# EAGLE design Module_PowerSource (EAGLE 9.6.2)
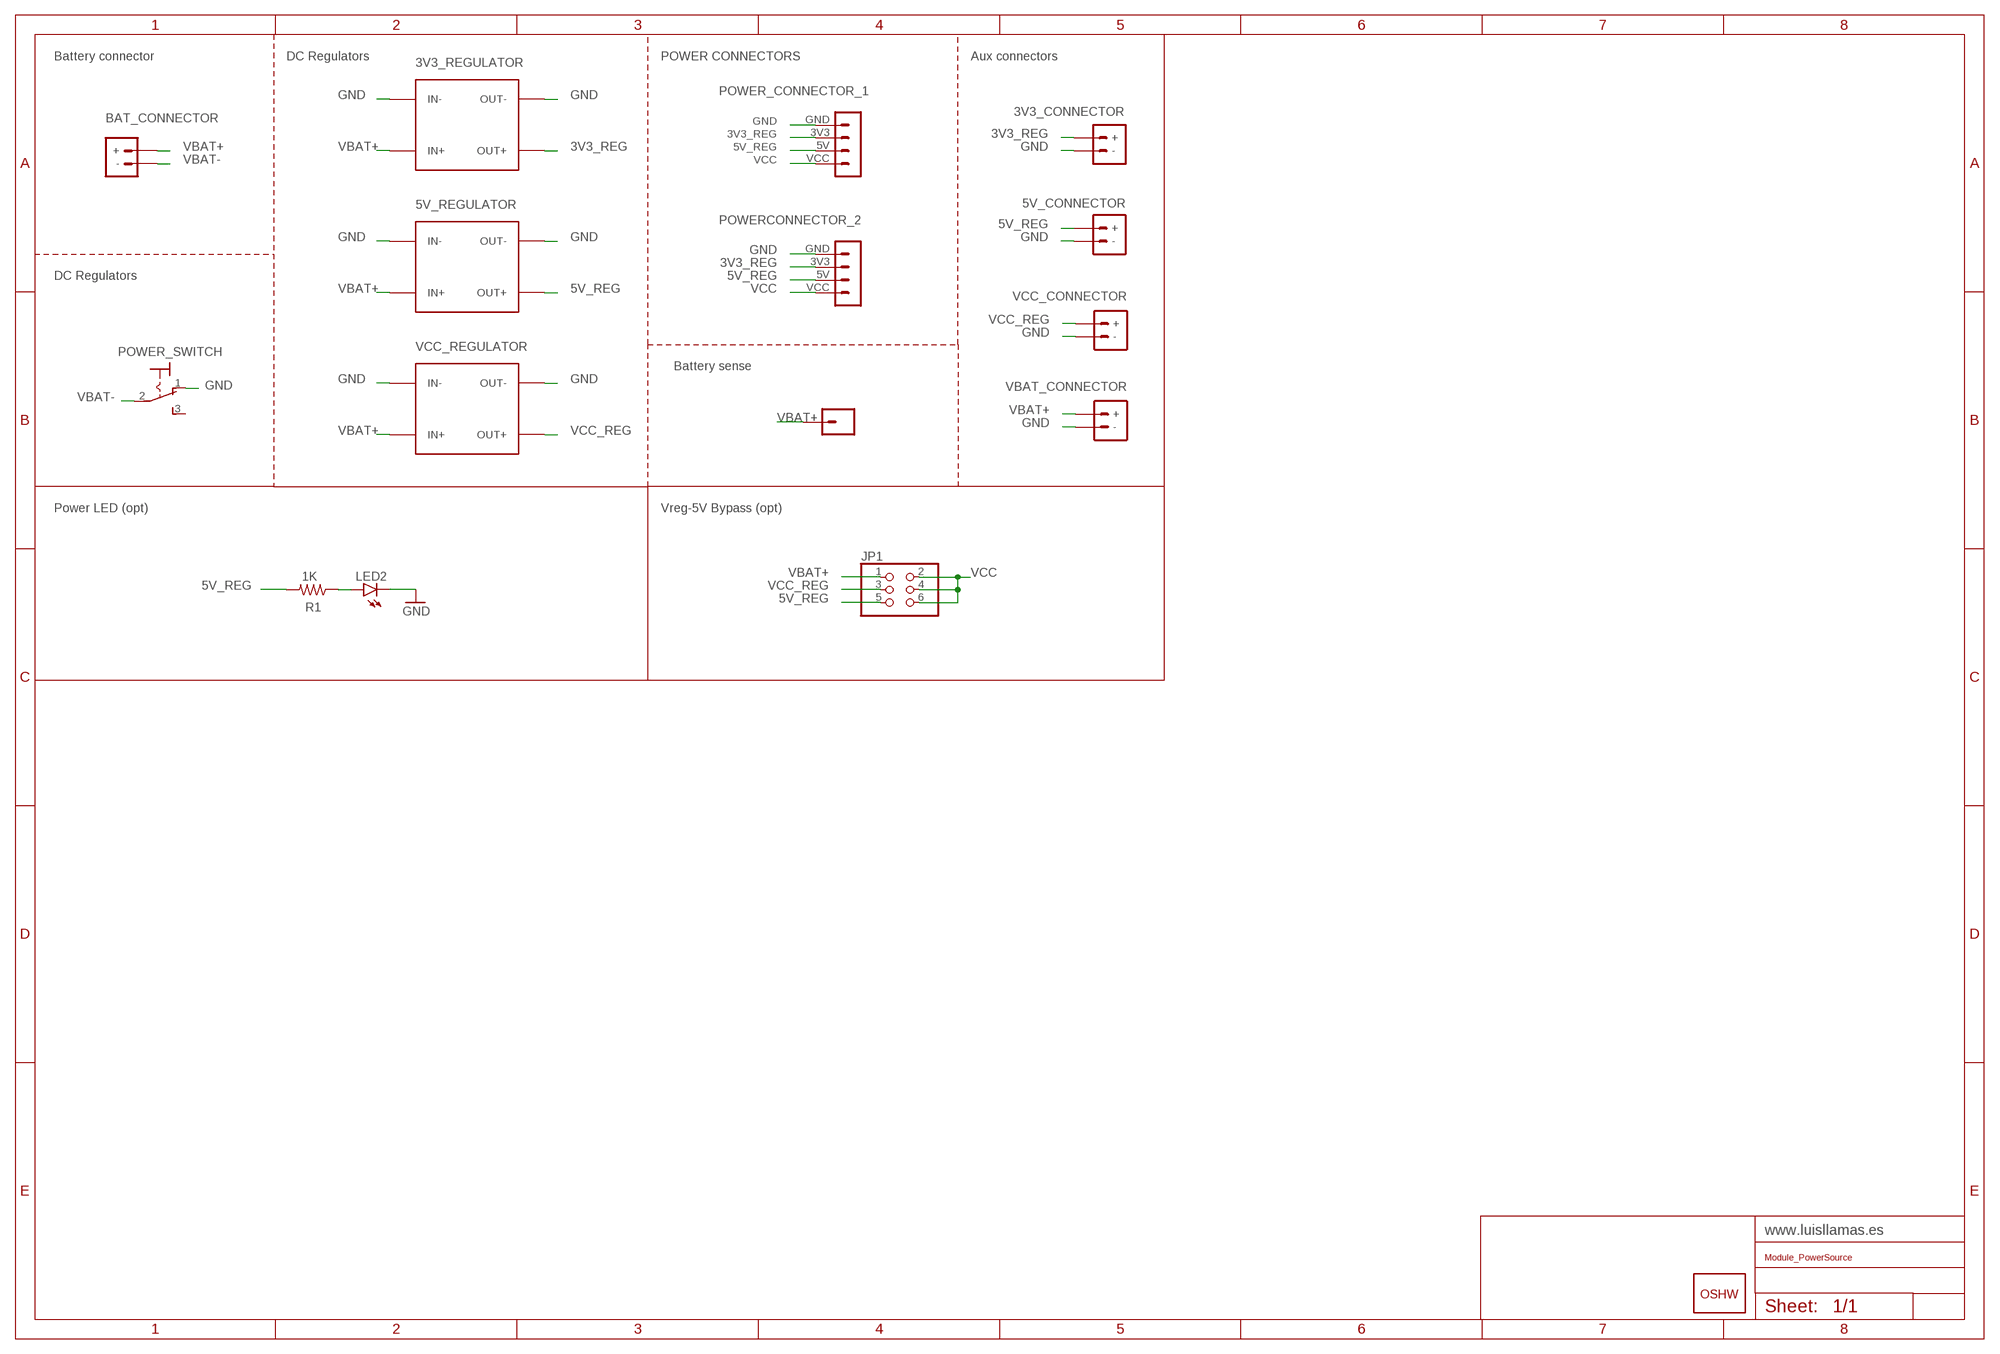
[diagram p0: schematic, sheet 1]

## Parts
3V3_CONNECTOR  MOTOR-TERMINAL2.54MM_SCREWTERM  [1X02_2.54_SCREWTERM]
3V3_REGULATOR  MINI-DC-STEP-DOWN-MP2307  [MINI-DC-STEP-DOWN-MP2307]
5V_CONNECTOR  MOTOR-TERMINAL2.54MM_SCREWTERM  [1X02_2.54_SCREWTERM]
5V_REGULATOR  MINI-DC-STEP-DOWN-MP2307  [MINI-DC-STEP-DOWN-MP2307]
BAT_CONNECTOR  POWER-TERMINAL5MM  [SCREWTERMINAL-5MM-2]
GOLD_ORB_SM1  OSHWLOGO_GOLD_ORB_MED  [OSHW1]
J3  CONN_01  [1X01]
JP1  JUMPER_3X2/OCT  [JUMPER_3X2]
LED2  LEDCHIP-LED0805  [CHIP-LED0805]
POWER_CONNECTOR_1  POWER-CONNECTOR  [POWER-CONNECTOR]
POWER_SWITCH  LEVER-POWER-SWITCH  [LEVER-POWER-SWITCH]
POWERCONNECTOR_2  POWER-CONNECTOR  [POWER-CONNECTOR]
R1  1K  R-US_R0805  [R0805]
VBAT_CONNECTOR  MOTOR-TERMINAL2.54MM_SCREWTERM  [1X02_2.54_SCREWTERM]
VCC_CONNECTOR  MOTOR-TERMINAL2.54MM_SCREWTERM  [1X02_2.54_SCREWTERM]
VCC_REGULATOR  MINI-DC-STEP-DOWN-MP2307  [MINI-DC-STEP-DOWN-MP2307]

## Nets
3V3_REG: 3V3_CONNECTOR.+ 3V3_REGULATOR.OUT2.+(OUT+) 3V3_REGULATOR.OUT+ POWER_CONNECTOR_1.3V3 POWERCONNECTOR_2.3V3
5V_REG: 5V_CONNECTOR.+ 5V_REGULATOR.OUT2.+(OUT+) 5V_REGULATOR.OUT+ JP1.5 POWER_CONNECTOR_1.5V POWERCONNECTOR_2.5V R1.2
GND: 3V3_CONNECTOR.- 3V3_REGULATOR.IN- 3V3_REGULATOR.OUT- 5V_CONNECTOR.- 5V_REGULATOR.IN- 5V_REGULATOR.OUT- LED2.C POWER_CONNECTOR_1.GND POWER_SWITCH.1(O) POWERCONNECTOR_2.GND VBAT_CONNECTOR.- VCC_CONNECTOR.- VCC_REGULATOR.IN- VCC_REGULATOR.OUT-
N$1: LED2.A R1.1
VBAT+: 3V3_REGULATOR.IN+ 3V3_REGULATOR.IN.2+(IN+) 5V_REGULATOR.IN+ 5V_REGULATOR.IN.2+(IN+) BAT_CONNECTOR.+ J3.1 JP1.1 VBAT_CONNECTOR.+ VCC_REGULATOR.IN+ VCC_REGULATOR.IN.2+(IN+)
VBAT-: BAT_CONNECTOR.- POWER_SWITCH.2(P)
VCC: JP1.2 JP1.4 JP1.6 POWER_CONNECTOR_1.VCC POWERCONNECTOR_2.VCC
VCC_REG: JP1.3 VCC_CONNECTOR.+ VCC_REGULATOR.OUT2.+(OUT+) VCC_REGULATOR.OUT+
Unconnected: POWER_SWITCH.3(S)

## Notes on the sheet
- Battery connector | DC Regulators | POWER CONNECTORS | Aux connectors
- DC Regulators
- Battery sense
- Power LED (opt) | Vreg-5V Bypass (opt)

## Library data of the parts
3V3_CONNECTOR 5V_CONNECTOR VBAT_CONNECTOR VCC_CONNECTOR = LLL_Motors:MOTOR-TERMINAL: Multi connection point. Often used as Generic Header-pin footprint for 0.1 inch spaced/style header connections On any of the 0.1 inch spaced packages, you can populate with these: Break Away Headers - Straight <https://www.sparkfun.com/products/116> (PRT-00116) Break Away Male Headers - Right Angle <https://www.sparkfun.com/products/553> (PRT-00553) Female Headers <https://www.sparkfun.com/products/115> (PRT-00115) Break Away Headers - Machine Pin <https://www.sparkfun.com/products/117> (PRT-00117) Break Away Female Headers - Swiss Machine Pin <https://www.sparkfun.com/products/743> (PRT-00743) For SCREWTERMINALS and SPRING TERMINALS visit here: Screw Terimnals on SparkFun.com <https://www.sparkfun.com/search/results?term=Screw+Terminals> (5mm/3.5mm/2.54mm spacing) This device is also useful as a general connection point to wire up your design to another part of your project. Our various solder wires solder well into these plated through hole pads. Hook-Up Wire - Assortment (Stranded, 22 AWG) <https://www.sparkfun.com/products/11375> (PRT-11375) Hook-Up Wire - Assortment (Solid Core, 22 AWG) <https://www.sparkfun.com/products/11367> (PRT-11367) View the entire wire category on our website here <https://www.sparkfun.com/categories/141> Special notes: Molex polarized connector foot print use with: PRT-08233 with associated crimp pins and housings. 2.54_SCREWTERM for use with PRT-10571. 3.5mm Screw Terminal footprints for PRT-08084 5mm Screw Terminal footprints for use with PRT-08432
3V3_REGULATOR 5V_REGULATOR VCC_REGULATOR = LLL_Power:MINI-DC-STEP-DOWN-MP2307: DC/DC Step-Down Regulator based on MP2307DN chip MP2307 datasheet available here: https://cdn-shop.adafruit.com/datasheets/MP2307_r1.9.pdf Click here to find device on ebay.com <http://www.ebay.com/sch/dc+dc+3a+mini+converter>
BAT_CONNECTOR = LLL_Power:POWER-TERMINAL: Multi connection point. Often used as Generic Header-pin footprint for 0.1 inch spaced/style header connections On any of the 0.1 inch spaced packages, you can populate with these: Break Away Headers - Straight <https://www.sparkfun.com/products/116> (PRT-00116) Break Away Male Headers - Right Angle <https://www.sparkfun.com/products/553> (PRT-00553) Female Headers <https://www.sparkfun.com/products/115> (PRT-00115) Break Away Headers - Machine Pin <https://www.sparkfun.com/products/117> (PRT-00117) Break Away Female Headers - Swiss Machine Pin <https://www.sparkfun.com/products/743> (PRT-00743) For SCREWTERMINALS and SPRING TERMINALS visit here: Screw Terimnals on SparkFun.com <https://www.sparkfun.com/search/results?term=Screw+Terminals> (5mm/3.5mm/2.54mm spacing) This device is also useful as a general connection point to wire up your design to another part of your project. Our various solder wires solder well into these plated through hole pads. Hook-Up Wire - Assortment (Stranded, 22 AWG) <https://www.sparkfun.com/products/11375> (PRT-11375) Hook-Up Wire - Assortment (Solid Core, 22 AWG) <https://www.sparkfun.com/products/11367> (PRT-11367) View the entire wire category on our website here <https://www.sparkfun.com/categories/141> Special notes: Molex polarized connector foot print use with: PRT-08233 with associated crimp pins and housings. 2.54_SCREWTERM for use with PRT-10571. 3.5mm Screw Terminal footprints for PRT-08084 5mm Screw Terminal footprints for use with PRT-08432; SF_SKU: PRT-08432
GOLD_ORB_SM1 = LLL_Frames:OSHWLOGO: These are Open-Source Hardware logos.
J3 = SparkFun-Connectors:CONN_01: Single connection point. Often used as Generic Header-pin footprint for 0.1 inch spaced/style header connections On any of the 0.1 inch spaced packages, you can populate with these: Break Away Headers - Straight <https://www.sparkfun.com/products/116> (PRT-00116) Break Away Male Headers - Right Angle <https://www.sparkfun.com/products/553> (PRT-00553) Female Headers <https://www.sparkfun.com/products/115> (PRT-00115) Break Away Headers - Machine Pin <https://www.sparkfun.com/products/117> (PRT-00117) Break Away Female Headers - Swiss Machine Pin <https://www.sparkfun.com/products/743> (PRT-00743) This device is also useful as a general connection point to wire up your design to another part of your project. Our various solder wires solder well into these plated through hole pads. Hook-Up Wire - Assortment (Stranded, 22 AWG) <https://www.sparkfun.com/products/11375> (PRT-11375) Hook-Up Wire - Assortment (Solid Core, 22 AWG) <https://www.sparkfun.com/products/11367> (PRT-11367) View the entire wire category on our website here <https://www.sparkfun.com/categories/141> Special notes: SMTSO-256-ET is a "flush mount" nut for a 4-40 screw. We mostly use this on specialty testbeds; it is a nice way to connect hardware to your PCB at an adjustable hieght. Also note, the SNAP packages are for using a snappable style connector. We sell a baggie of snaps and they are also used on two LilyPad designs: Snap Assortment - 30 pack (male and female) <https://www.sparkfun.com/products/11347> (DEV-11347) LilyPad Arduino SimpleSnap <https://www.sparkfun.com/products/10941> (DEV-10941) LilyPad SimpleSnap Protoboard <https://www.sparkfun.com/products/10940> (DEV-10940)
JP1 = LLL_Jumpers:JUMPER_3X2: Header ISR
LED2 = led:LED: LED OSRAM: - CHIPLED LG R971, LG N971, LY N971, LG Q971, LY Q971, LO R971, LY R971 LH N974, LH R974 LS Q976, LO Q976, LY Q976 LO Q996 - Hyper CHIPLED LW Q18S LB Q993, LB Q99A, LB R99A - SideLED LS A670, LO A670, LY A670, LG A670, LP A670 LB A673, LV A673, LT A673, LW A673 LH A674 LY A675 LS A676, LA A676, LO A676, LY A676, LW A676 LS A679, LY A679, LG A679 - Hyper Micro SIDELED® LS Y876, LA Y876, LO Y876, LY Y876 LT Y87S - SmartLED LW L88C, LW L88S LB L89C, LB L89S, LG L890 LS L89K, LO L89K, LY L89K LS L896, LA L896, LO L896, LY L896 - TOPLED LS T670, LO T670, LY T670, LG T670, LP T670 LSG T670, LSP T670, LSY T670, LOP T670, LYG T670 LG T671, LOG T671, LSG T671 LB T673, LV T673, LT T673, LW T673 LH T674 LS T676, LA T676, LO T676, LY T676, LB T676, LH T676, LSB T676, LW T676 LB T67C, LV T67C, LT T67C, LS T67K, LO T67K, LY T67K, LW E67C LS E67B, LA E67B, LO E67B, LY E67B, LB E67C, LV E67C, LT E67C LW T67C LS T679, LY T679, LG T679 LS T770, LO T770, LY T770, LG T770, LP T770 LB T773, LV T773, LT T773, LW T773 LH T774 LS E675, LA E675, LY E675, LS T675 LS T776, LA T776, LO T776, LY T776, LB T776 LHGB T686 LT T68C, LB T68C - Hyper Mini TOPLED® LB M676 - Mini TOPLED Santana® LG M470 LS M47K, LO M47K, LY M47K Source: http://www.osram.convergy.de LUXEON: - LUMILED® LXK2-PW12-R00, LXK2-PW12-S00, LXK2-PW14-U00, LXK2-PW14-V00 LXK2-PM12-R00, LXK2-PM12-S00, LXK2-PM14-U00 LXK2-PE12-Q00, LXK2-PE12-R00, LXK2-PE12-S00, LXK2-PE14-T00, LXK2-PE14-U00 LXK2-PB12-K00, LXK2-PB12-L00, LXK2-PB12-M00, LXK2-PB14-N00, LXK2-PB14-P00, LXK2-PB14-Q00 LXK2-PR12-L00, LXK2-PR12-M00, LXK2-PR14-Q00, LXK2-PR14-R00 LXK2-PD12-Q00, LXK2-PD12-R00, LXK2-PD12-S00 LXK2-PH12-R00, LXK2-PH12-S00 LXK2-PL12-P00, LXK2-PL12-Q00, LXK2-PL12-R00 Source: www.luxeon.com KINGBRIGHT: KA-3528ASYC Source: www.kingbright.com
POWER_CONNECTOR_1 POWERCONNECTOR_2 = LLL_Power:POWER-CONNECTOR: JST Connector
POWER_SWITCH = LLL_Power:LEVER-POWER-SWITCH: TOGGLE SWITCH Marquardt
R1 = adafruit:R-US_: RESISTOR, American symbol

## Net classes
0 default: clearance 0.205 mm

## Board
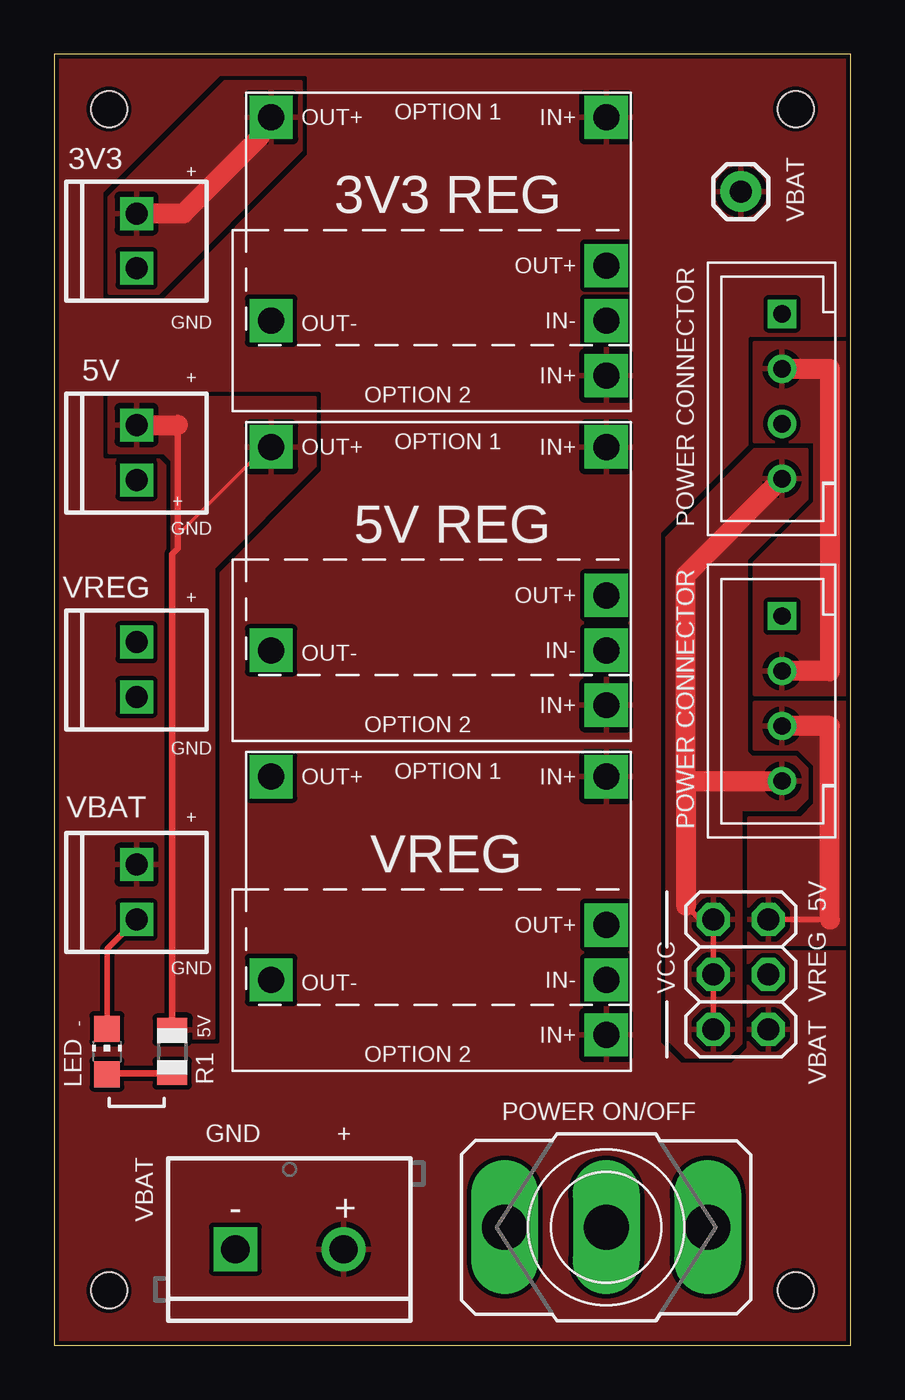
[diagram p1: board, top side]
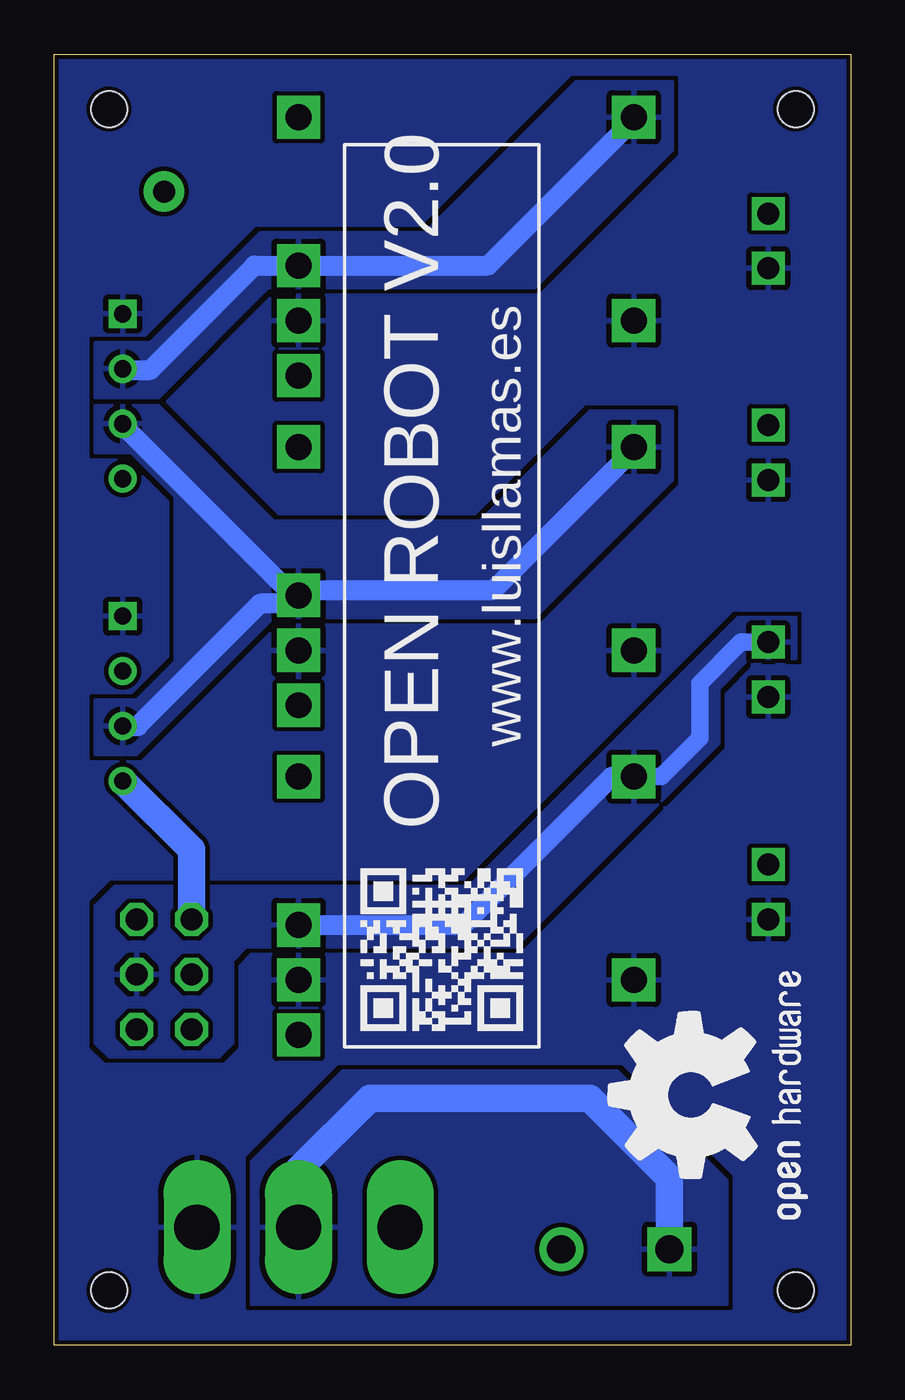
[diagram p2: board, bottom side, seen from below]

Size 36.83 x 59.69 mm. Coordinates in mm from the lower left corner, seen from the top.
Outline: 0,59.69 0,0 36.83,0 36.83,59.69 0,59.69
Copper layers (1*16): Top 0.035559375mm / dielectric 1.6mm / Bottom 0.035559375mm
Design rules "jlcpcb2layer": minimum track width 5mil, minimum drill 12mil, track to track 5mil, track to pad 5mil, pad to pad 5mil, via to via 5mil, smd to smd 5mil, copper to edge 8mil, drill to drill 6mil, minimum pad ring 5mil, minimum via ring 3mil, stop-mask expansion 2.5mil, vias tented up to drill 0mil, thermal gap 10mil
Holes 1.65 mm at 2.54,57.15 2.54,2.54 34.29,57.15 34.29,2.54

### Footprints (pad centres in the part's own frame; a part is rotated, then mirrored left to right if it is on the bottom)
1X02_2.54_SCREWTERM = drill 1.016 square: + 2.54,0; - 0,0
MINI-DC-STEP-DOWN-MP2307 = drill 1.2 pad 2 square: IN+ -7.747,-4.699; IN- -7.747,4.699; IN.2+ -7.747,7.239; OUT2.+ -7.747,2.159; OUT+ 7.747,-4.699; OUT- 7.747,4.699
SCREWTERMINAL-5MM-2 = drill 1.3 pad 2.032: + 5,0 | drill 1.3 pad 2.032 square: - 0,0
1X01 = drill 1.016 pad 1.88: 1 0,0
JUMPER_3X2 = drill 1.016 octagon: 1 -2.54,-1.27; 2 -2.54,1.27; 3 0,-1.27; 4 0,1.27; 5 2.54,-1.27; 6 2.54,1.27
CHIP-LED0805 = smd 1.2 x 1.2: A 0,-1.05; C 0,1.05
POWER-CONNECTOR = drill 0.8 pad 1.3: 3V3 0,1.326; 5V 0,-1.214; VCC 0,-3.754 | drill 0.8 pad 1.3 square: GND 0,3.866
LEVER-POWER-SWITCH = drill 2.083 long: 1 0,4.699; 2 0,0; 3 0,-4.699
R0805 = smd 1.1 x 1.4: 1 -1,0; 2 1,0

### Placement (x,y rotation side)
3V3_CONNECTOR  3.81,49.78 90 top
3V3_REGULATOR  17.78,52.07 180 top
5V_CONNECTOR  3.81,40.01 90 top
5V_REGULATOR  17.78,36.83 180 top
BAT_CONNECTOR  8.38,4.45 0 top
GOLD_ORB_SM1  0.25,5.21 90 bottom
J3  31.75,53.34 0 top
JP1  31.75,17.14 90 top
LED2  2.44,13.59 0 top
POWER_CONNECTOR_1  33.66,43.81 0 top
POWER_SWITCH  25.53,5.46 270 top
POWERCONNECTOR_2  33.66,29.84 0 top
R1  5.46,13.59 90 top
VBAT_CONNECTOR  3.81,19.68 90 top
VCC_CONNECTOR  3.81,29.97 90 top
VCC_REGULATOR  17.78,21.59 180 top

### Tracks (layer width: path | path; a pad name or v marks a point on that pad's centre or on a via)
3V3_REG
  Top 0.914: 3V3_CONNECTOR.+ 5.97,52.32 9.53,55.88 9.53,56.52 3V3_REGULATOR.OUT+ | POWER_CONNECTOR_1.3V3 35.87,45.14 35.87,31.17 POWERCONNECTOR_2.3V3
  Bottom 0.914: POWER_CONNECTOR_1.3V3 33.66,45.09 32.38,45.09 27.56,49.91 3V3_REGULATOR.OUT2.+ 16.76,49.91 10.16,56.52 3V3_REGULATOR.OUT+
  pour Bottom: 8.26,58.42 12.7,58.42 19.68,51.44 27.3,51.44 32.38,46.35 34.92,46.35 34.92,43.81 32,43.81 26.92,48.9 14.61,48.9 8.26,55.24
  pour Top: 2.54,53.09 2.54,48.64 4.83,48.64 11.43,55.24 11.43,58.42 7.87,58.42
  pour Top: 32.38,46.35 36.83,46.35 36.83,30.1 32.38,30.1 32.38,36.2 35.18,38.99 35.18,41.78 32.38,41.78
5V_REG
  Top 0.152: 9.53,41.27 5.71,37.47 5.71,36.83
  Top 0.254: JP1.5 35.87,19.68
  Top 0.305: 5.71,42.55 5.71,36.83 5.46,36.58 R1.2
  Top 0.914: 5V_CONNECTOR.+ 5.71,42.55 | 9.53,41.27 5V_REGULATOR.OUT+ | POWERCONNECTOR_2.5V 35.87,28.63 35.87,19.68
  Bottom 0.914: POWERCONNECTOR_2.5V 32.96,28.63 27.3,34.29 26.04,34.29 5V_REGULATOR.OUT2.+ | POWER_CONNECTOR_1.5V 33.66,42.55 26.04,34.92 5V_REGULATOR.OUT2.+ | 5V_REGULATOR.OUT+ 10.16,41.27 16.51,34.92 25.4,34.92 5V_REGULATOR.OUT2.+
  pour Bottom: 8.26,43.18 12.06,43.18 17.14,38.1 26.67,38.1 32,43.43 34.92,43.43 34.92,41.27 33.27,41.27 31.24,39.24 31.24,31.62 33.02,29.84 34.92,29.84 34.92,27.3 33.02,27.3 26.67,33.66 14.61,33.66 8.26,40.01
  pour Top: 2.54,43.81 12.06,43.81 12.06,40.64 7.37,35.94 7.37,14.22 5.46,14.22 5.46,40.89 5.08,41.27 2.54,41.27
  pour Top: 32.38,29.72 36.83,29.72 36.83,18.54 32.13,18.54 32.13,24.38 34.54,24.38 35.18,25.02 35.18,26.8 34.42,27.56 32.38,27.56
GND
  Top 0.254: LED2.C 2.44,18.32 VBAT_CONNECTOR.-
  pour Bottom (rank 2): 0,0 0,59.69 36.83,59.69 36.83,0
N$1
  Top 0.305: R1.1 5.45,12.57 2.48,12.57 LED2.A
VBAT+
  pour Top (rank 2): 0,59.69 0,0 36.83,0 36.83,59.69
VBAT-
  Bottom 1.27: BAT_CONNECTOR.- 8.38,7.75 12.06,11.43 22.23,11.43 25.53,8.13 POWER_SWITCH.2
  pour Bottom: 5.71,1.91 27.69,1.91 27.69,8.51 23.5,12.7 10.79,12.7 5.71,7.62
VCC
  Top 0.254: 29.21,20.32 29.84,19.68 JP1.6 JP1.4 JP1.2
  Top 0.914: 29.21,26.04 29.21,20.32 | 29.21,26.04 29.27,26.09 POWERCONNECTOR_2.VCC | 29.21,26.04 29.21,35.62 POWER_CONNECTOR_1.VCC
  Bottom 1.27: JP1.6 30.48,22.92 POWERCONNECTOR_2.VCC
  pour Top: 34.8,41.4 32.38,41.4 28.32,37.34 28.32,14.22 29.21,13.34 31.11,13.34 31.75,13.97 31.75,24.77 34.29,24.77 34.8,25.27 34.8,26.67 34.29,27.18 32.26,27.18 32,27.43 32,36.32 34.8,39.12
VCC_REG
  Bottom 0.813: VCC_CONNECTOR.+ 5.08,32.51 6.99,30.61 6.99,28.07 8.76,26.29 VCC_REGULATOR.OUT+
  Bottom 0.914: VCC_REGULATOR.OUT+ 11.05,26.29 17.91,19.43 VCC_REGULATOR.OUT2.+
  pour Bottom: 6.1,27.81 6.1,30.35 4.7,31.75 2.54,31.75 2.54,33.66 5.21,33.66 17.65,21.21 34.04,21.21 34.92,20.32 34.92,13.97 34.29,13.34 29.21,13.34 28.57,13.97 28.57,17.78 27.94,18.41 15.49,18.41

### Text on the board
tPlace: 3V3 | + | 3V3 REG | VBAT | GND | 5V | + | + | POWER CONNECTOR | GND | 5V REG | VREG | + | GND | VBAT | + | POWER CONNECTOR | VREG | 5V | GND | VCC | VREG | - | 5V | LED | VBAT | POWER ON/OFF | GND | + | VBAT
bPlace: www.luisllamas.es | OPEN ROBOT V2.0